# Altium project lv_1.PrjPCB
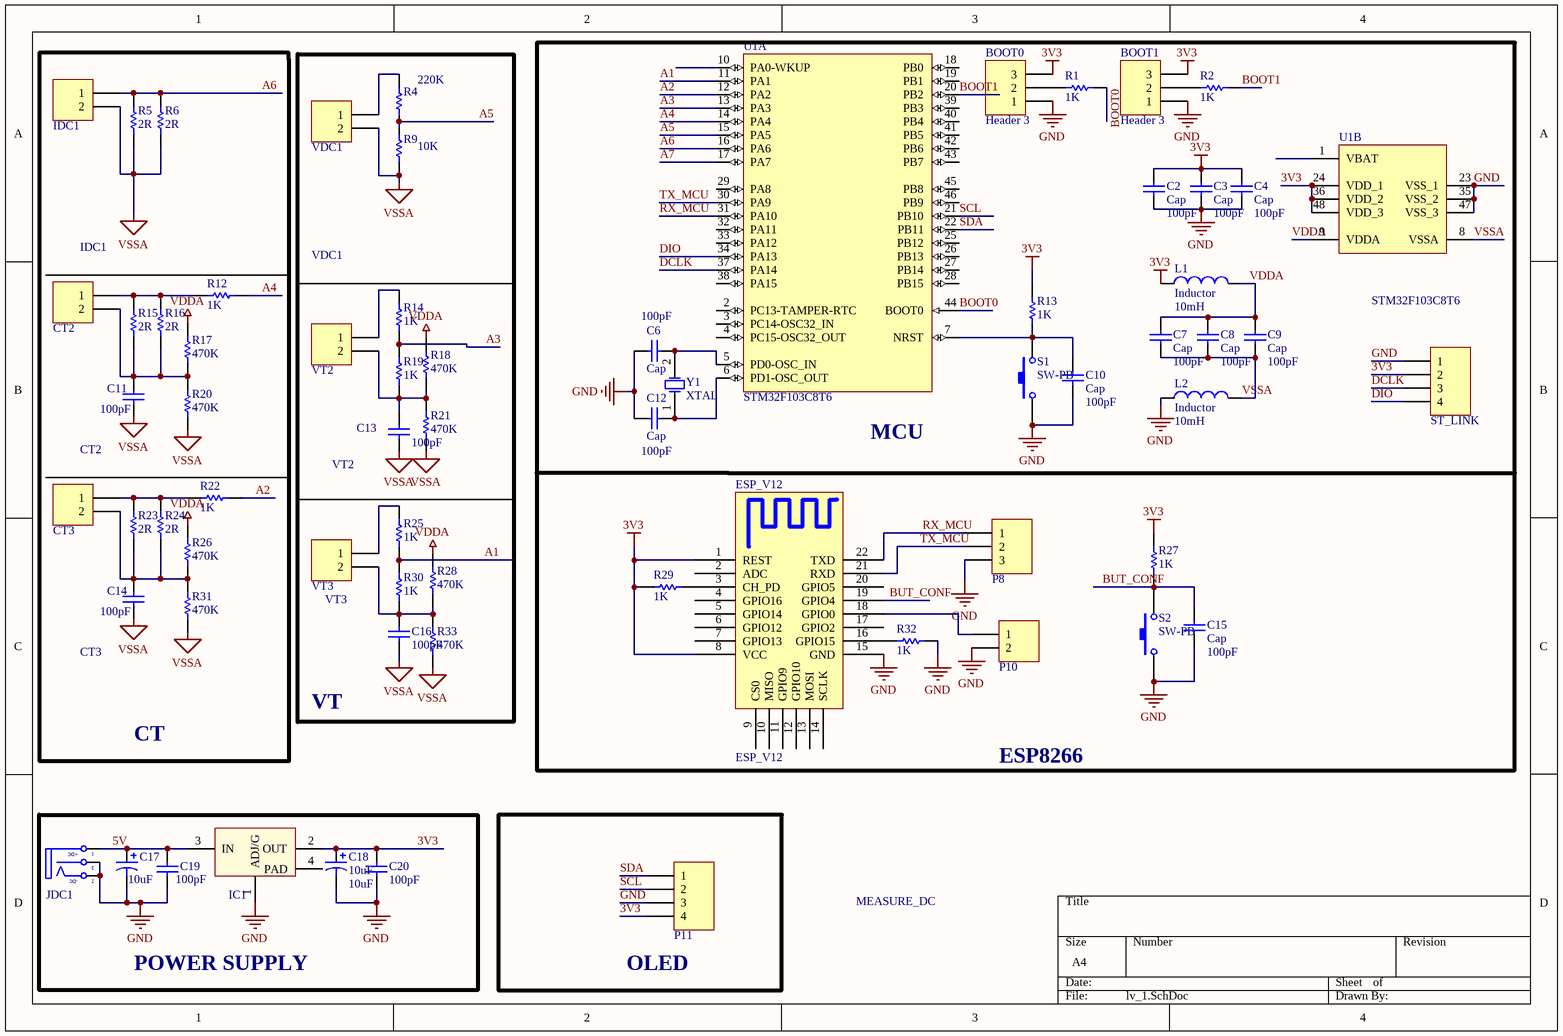
[diagram p0: lv_1.SchDoc]
1 sheet, 67 parts. Net scope: global (net labels, ports and power ports of the same name join across sheets).
Board files: lv_1.PcbDoc, PCB1.PcbDoc

## Sheet lv_1.SchDoc
size A4

### Parts
BOOT0  Header 3  [JP3]
BOOT1  Header 3  [JP3]
C2  Cap  value 100pF  [CAP-SM-0603]
C3  Cap  value 100pF  [CAP-SM-0603]
C4  Cap  value 100pF  [CAP-SM-0603]
C6  Cap  value 100pF  [CAP-SM-0603]
C7  Cap  value 100pF  [CAP-SM-0603]
C8  Cap  value 100pF  [CAP-SM-0603]
C9  Cap  value 100pF  [CAP-SM-0603]
C10  Cap  value 100pF  [CAP-SM-0603]
C11  value 100pF  [CAP-SM-0603]  (hidden comment: Cap Non-Pol SMD)
C12  Cap  value 100pF  [CAP-SM-0603]
C13  value 100pF  [CAP-SM-0603]  (hidden comment: Cap Non-Pol SMD)
C14  value 100pF  [CAP-SM-0603]  (hidden comment: Cap Non-Pol SMD)
C15  Cap  value 100pF  [CAP-SM-0603]
C16  value 100pF  [CAP-SM-0603]  (hidden comment: Cap Non-Pol SMD)
C17  10uF  [CP1/2]
C18  10uF  [CP1/2]
C19  value 100pF  [CAP-SM-0603]  (hidden comment: Cap Non-Pol SMD)
C20  value 100pF  [CAP-SM-0603]  (hidden comment: Cap Non-Pol SMD)
CT2  Domino 2  [DOMINO 2- 5mm]  (value not drawn)
CT3  Domino 2  [DOMINO 2- 5mm]  (value not drawn)
ESP_V12  ESP_V12  [ESP_12_E]
IC1  LM1117  [SOT223-4N]  (value not drawn)
IDC1  Domino 2  [DOMINO 2- 5mm]  (value not drawn)
JDC1  Jack DC  [DC-IN]  (value not drawn)
L1  Inductor  value 10mH  [CAP-SM-0603]
L2  Inductor  value 10mH  [CAP-SM-0603]
P8  Header 3  [JP3]  (value not drawn)
P10  Header 2  [JP2]  (value not drawn)
P11  Header 4  [JP4]  (value not drawn)
R1  value 1K  [RES-SM-0603]  (hidden comment: RESISTOR SMD)
R2  value 1K  [RES-SM-0603]  (hidden comment: RESISTOR SMD)
R4  220K  [RES-SM-0603]
R5  value 2R  [RES-SM-0603]  (hidden comment: RESISTOR SMD)
R6  value 2R  [RES-SM-0603]  (hidden comment: RESISTOR SMD)
R9  10K  [RES-SM-0603]
R12  value 1K  [RES-SM-0603]  (hidden comment: RESISTOR SMD)
R13  value 1K  [RES-SM-0603]  (hidden comment: RESISTOR SMD)
R14  value 1K  [RES-SM-0603]  (hidden comment: RESISTOR SMD)
R15  value 2R  [RES-SM-0603]  (hidden comment: RESISTOR SMD)
R16  value 2R  [RES-SM-0603]  (hidden comment: RESISTOR SMD)
R17  value 470K  [RES-SM-0603]  (hidden comment: RESISTOR SMD)
R18  value 470K  [RES-SM-0603]  (hidden comment: RESISTOR SMD)
R19  value 1K  [RES-SM-0603]  (hidden comment: RESISTOR SMD)
R20  value 470K  [RES-SM-0603]  (hidden comment: RESISTOR SMD)
R21  value 470K  [RES-SM-0603]  (hidden comment: RESISTOR SMD)
R22  value 1K  [RES-SM-0603]  (hidden comment: RESISTOR SMD)
R23  value 2R  [RES-SM-0603]  (hidden comment: RESISTOR SMD)
R24  value 2R  [RES-SM-0603]  (hidden comment: RESISTOR SMD)
R25  value 1K  [RES-SM-0603]  (hidden comment: RESISTOR SMD)
R26  value 470K  [RES-SM-0603]  (hidden comment: RESISTOR SMD)
R27  value 1K  [RES-SM-0603]  (hidden comment: RESISTOR SMD)
R28  value 470K  [RES-SM-0603]  (hidden comment: RESISTOR SMD)
R29  value 1K  [RES-SM-0603]  (hidden comment: RESISTOR SMD)
R30  value 1K  [RES-SM-0603]  (hidden comment: RESISTOR SMD)
R31  value 470K  [RES-SM-0603]  (hidden comment: RESISTOR SMD)
R32  value 1K  [RES-SM-0603]  (hidden comment: RESISTOR SMD)
R33  value 470K  [RES-SM-0603]  (hidden comment: RESISTOR SMD)
S1  SW-PB  [Tact SW 4 pin]
S2  SW-PB  [Tact SW 4 pin]
ST_LINK  Header 4  [JP4]  (value not drawn)
U1  STM32F103C8T6  [STM-LQFP48_L]  (parts A,B of 2)
VDC1  Domino 2  [DOMINO 2- 5mm]  (value not drawn)
VT2  Domino 2  [DOMINO 2- 5mm]  (value not drawn)
VT3  Domino 2  [DOMINO 2- 5mm]  (value not drawn)
Y1  XTAL  [XT2]

### Blocks framed on the sheet
CT: C11 C14 CT2 CT3 IDC1 R5 R6 R12 R15-R17 R20 R22-R24 R26 R31
POWER SUPPLY: C17-C20 IC1 JDC1
OLED: P11

### Nets
3V3: BOOT0.3 BOOT1.3 C2.2 C3.2 C4.2 C18.1 C20.2 ESP_V12.1(REST) ESP_V12.8(VCC) IC1.2(OUT) L1.1 P11.4 R13.1 R27.1 R29.1 ST_LINK.2 U1.24(VDD_1) U1.36(VDD_2) U1.48(VDD_3)
GND: BOOT0.1 BOOT1.1 C2.1 C3.1 C4.1 C6.1 C10.1 C12.1 C15.1 C17.2 C18.2 C19.1 C20.1 ESP_V12.15(GND) IC1.1(ADJ/G) JDC1.2(TN) JDC1.3(S) L2.1 P8.3 P10.2 P11.3 R32.2 S1.1 S2.1 ST_LINK.1 U1.23(VSS_1) U1.35(VSS_2) U1.47(VSS_3)
VDDA: C7.2 C8.2 C9.2 L1.2 R17.2 R18.2 R26.2 R28.2 U1.9(VDDA)
VSSA: C7.1 C8.1 C9.1 C11.1 C13.1 C14.1 C16.1 IDC1.2 L2.2 R5.1 R6.1 R9.1 R20.1 R21.1 R31.1 R33.1 U1.8(VSSA) VDC1.2
5V: C17.1 C19.2 IC1.3(IN) JDC1.1(T)
A1: R25.1 R30.2 U1.11(PA1)
A2: R22.1 U1.12(PA2)
A3: R14.1 R19.2 U1.13(PA3)
A4: R12.1 U1.14(PA4)
A5: R4.1 R9.2 U1.15(PA5)
A6: IDC1.1 R5.2 R6.2 U1.16(PA6)
A7: U1.17(PA7)
BOOT0: R1.1 U1.44(BOOT0)
BOOT1: R2.1 U1.20(PB2)
BUT_CONF: C15.2 ESP_V12.19(GPIO4) R27.2 S2.2
DCLK: ST_LINK.3 U1.37(PA14)
DIO: ST_LINK.4 U1.34(PA13)
RX_MCU: ESP_V12.22(TXD) P8.1 U1.31(PA10)
SCL: P11.2 U1.21(PB10)
SDA: P11.1 U1.22(PB11)
TX_MCU: ESP_V12.21(RXD) P8.2 U1.30(PA9)
NetBOOT0_2: BOOT0.2 R1.2
NetBOOT1_2: BOOT1.2 R2.2
NetC6_2: C6.2 U1.5(PD0-OSC_IN) Y1.2(OSC2)
NetC10_2: C10.2 R13.2 S1.2 U1.7(NRST)
NetC11_2: C11.2 CT2.2 R15.1 R16.1 R17.1 R20.2
NetC12_2: C12.2 U1.6(PD1-OSC_OUT) Y1.1(OSC1)
NetC13_2: C13.2 R18.1 R19.1 R21.2 VT2.2
NetC14_2: C14.2 CT3.2 R23.1 R24.1 R26.1 R31.2
NetC16_2: C16.2 R28.1 R30.1 R33.2 VT3.2
NetCT2_1: CT2.1 R12.2 R15.2 R16.2
NetCT3_1: CT3.1 R22.2 R23.2 R24.2
NetESP_V12_3: ESP_V12.3(CH_PD) R29.2
NetESP_V12_16: ESP_V12.16(GPIO15) R32.1
NetESP_V12_18: ESP_V12.18(GPIO0) P10.1
NetR4_2: R4.2 VDC1.1
NetR14_2: R14.2 VT2.1
NetR25_2: R25.2 VT3.1

Not connected (* = marked no-connect by the designer): ESP_V12 2(ADC) 4(GPIO16) 5(GPIO14) 6(GPIO12) 7(GPIO13) 9(CS0) 10(MISO) 11(GPIO9) 12(GPIO10) 13(MOSI) 14(SCLK) 17(GPIO2) 20(GPIO5); IC1 4(PAD); U1 1(VBAT) 2(PC13-TAMPER-RTC) 3(PC14-OSC32_IN) 4(PC15-OSC32_OUT) 10(PA0-WKUP) 18(PB0) 19(PB1) 25(PB12) 26(PB13) 27(PB14) 28(PB15) 29(PA8) 32(PA11) 33(PA12) 38(PA15) 39(PB3) 40(PB4) 41(PB5) 42(PB6) 43(PB7) 45(PB8) 46(PB9)

### Notes on the sheet
- IDC1
- VDC1
- (near U1) MCU
- CT2
- VT2
- CT3
- (near VT3) VT3
- VT
- ESP8266
- MEASURE_DC
- (in symbol Jack DC) +DC; -DC

### Library data of the parts
BOOT0 BOOT1 P8 = Header 3: Header, 3-Pin; LatestRevisionDate: 17-Jul-2002; LatestRevisionNote: Re-released for DXP Platform.; Publisher: Altium Limited
C2-C4 C6-C10 C12 C15 = Cap: Capacitor; Published: 8-Jun-2000; LatestRevisionDate: 17-Jul-2002; LatestRevisionNote: Re-released for DXP Platform.; PackageReference: RAD-0.3; Publisher: Altium Limited; PackageDescription: Radial Cap, Thru-Hole; 2 Leads; 0.3 in Pin Spacing
C11 C13 C14 C16 C19 C20 = Cap Non-Pol SMD: Capacitor
C17 C18 = Cap Pol1: Polarized Capacitor (Radial); Published: 8-Jun-2000; LatestRevisionDate: 17-Jul-2002; LatestRevisionNote: Re-released for DXP Platform.; PackageReference: RB7.6-15; Publisher: Altium Limited; PackageDescription: Polarized Capacitor (Radial); 2 Leads; Value: 10uF
CT2 CT3 IDC1 VDC1 VT2 VT3 = Domino 2: Domino, 2-Pin; LatestRevisionDate: 17-Jul-2002; LatestRevisionNote: Re-released for DXP Platform.; Publisher: Altium Limited
ESP_V12 = Component_1
IC1 = LM1117: Available in 1.8V, 2.5V, 2.85V, 3.3V, 5V, and  Adjustable Versions; Value: LM317
JDC1 = Jack DC: Jack DC input; Value: Jac DC
L1 L2 = Inductor: Code_IEC: 1005; Published: 8-Jun-2000; LatestRevisionDate: 29-May-2009; LatestRevisionNote: IPC-7351 Footprint Added.; PackageReference: 0402-A; Publisher: Altium Limited; PackageDescription: Chip Inductor; Code_JEITA: 0402
P10 = Header 2: Header, 2-Pin; LatestRevisionDate: 17-Jul-2002; LatestRevisionNote: Re-released for DXP Platform.; Publisher: Altium Limited
P11 ST_LINK = Header 4: Header, 4-Pin; LatestRevisionDate: 17-Jul-2002; LatestRevisionNote: Re-released for DXP Platform.; Publisher: Altium Limited
R1 R2 R5 R6 R12-R33 = RESISTOR SMD: Resistor
R4 R9 = RESISTOR SMD: Resistor; Value: 1K
S1 S2 = SW-PB: Switch; Published: 24-Mar-1999; LatestRevisionDate: 17-Jul-2002; LatestRevisionNote: Re-released for DXP Platform.; PackageReference: SPST-2; Publisher: Altium Limited; PackageDescription: Switch; 2 Leads
U1 = STM32F103C8T6: ARM Cortex-M3 32-bit MCU, 64 KB Flash, 20 KB Internal RAM, 37 I/Os, 48-pin LQFP, -40 to 85 degC, Tray; A/D Converter: 2x12-bit (10 Channel); FLASH Size (Prog) (kB): 64; I/Os (High Current): 37; Internal RAM Size (kB): 20; Operating Frequency(F) (Processor speed) (MHz): 72; Supply Voltage(Vcc) min (V): 2; DatasheetVersion: Rev. 16; PackageVersion: Rev. 6, 06/2013; PackageReference: LQFP48; PackageDescription: 48-Pin Low Profile Quad Flat Package, 7 x 7 mm Body, 0.5 mm Pitch; Supplier 1: Digi-Key; Supplier Part Number 1: 497-6063-ND; Supplier 2: Farnell; Supplier Part Number 2: 1447637; Supplier 3: Newark; Supplier Part Number 3: 59M2182; Supplier 4: Newark; Supplier Part Number 4: 57P1222; Supplier 5: Mouser; Supplier Part Number 5: 511-STM32F103C8T6; Core: ARM Cortex-M3; Packing: Tray; Mounting Technology: Surface Mount; PartNumber: STM32F103C8T6; ComponentLink1Description: Manufacturer URL; ComponentLink1URL: http://www.st.com/web/en/home.html; ComponentLink2Description: Datasheet; ComponentLink2URL: http://www.st.com/st-web-ui/static/active/en/resource/technical/document/datasheet/CD00161566.pdf; ComponentLink3Description: Package Specification; ComponentLink3URL: http://www.st.com/st-web-ui/static/active/en/resource/technical/document/datasheet/DM00058181.pdf
Y1 = XTAL: Crystal Oscillator; Published: 8-Jun-2000; LatestRevisionDate: 17-Jul-2002; LatestRevisionNote: Re-released for DXP Platform.; PackageReference: R38; Publisher: Altium Limited; PackageDescription: Crystal, Thru-Hole; 2 Leads; Body 3.1 x 8.2 mm (Dia.xH)